# Altium project Pedestal.PrjPcb
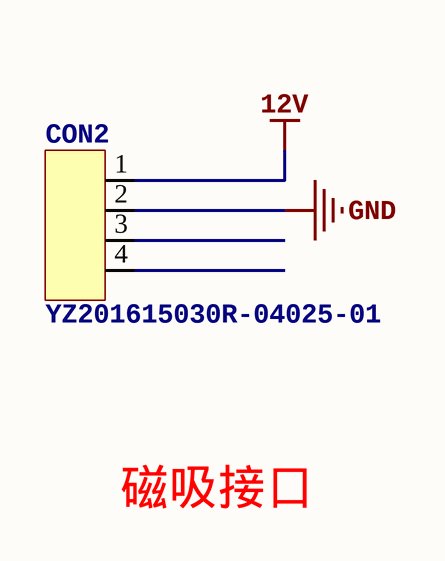
[diagram p0: Pedestal.SchDoc]
1 sheet, 1 parts. Net scope: global (net labels, ports and power ports of the same name join across sheets).
Board file: Pedestal.PcbDoc

## Sheet Pedestal.SchDoc
size A4

### Parts
CON2  YZ201615030R-04025-01

### Nets
12V: CON2.1
GND: CON2.2

Not connected (* = marked no-connect by the designer): CON2 3 4

### Notes on the sheet
- 磁吸接口

### Library data of the parts
CON2 = YZ201615030R-04025-01: 磁吸连接器